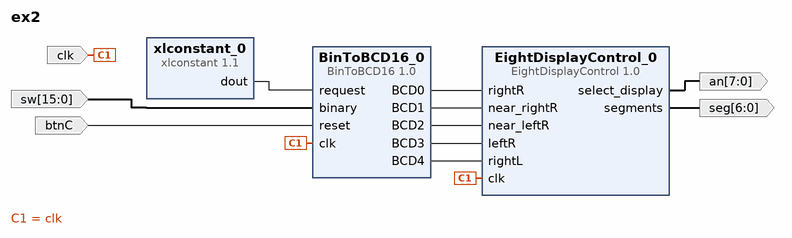
[diagram p0: block diagram of the top level]
# Vivado block design ex2, Vivado 2015.4
create_bd_design ex2

create_bd_port -dir I clk
create_bd_port -dir I -from 15 -to 0 sw
create_bd_port -dir O -from 7 -to 0 an
create_bd_port -dir O -from 6 -to 0 seg
create_bd_port -dir I btnC

create_bd_cell -type ip -vlnv ua.pt:user:BinToBCD16:1.0 BinToBCD16_0
create_bd_cell -type ip -vlnv xilinx.com:ip:xlconstant:1.1 xlconstant_0
create_bd_cell -type ip -vlnv ua.pt:user:EightDisplayControl:1.0 EightDisplayControl_0

# ---- connections ----

connect_bd_net [get_bd_pins xlconstant_0/dout] [get_bd_pins BinToBCD16_0/request]
connect_bd_net [get_bd_ports sw] [get_bd_pins BinToBCD16_0/binary]
connect_bd_net [get_bd_ports clk] [get_bd_pins BinToBCD16_0/clk] [get_bd_pins EightDisplayControl_0/clk]
connect_bd_net [get_bd_pins BinToBCD16_0/BCD0] [get_bd_pins EightDisplayControl_0/rightR]
connect_bd_net [get_bd_pins BinToBCD16_0/BCD1] [get_bd_pins EightDisplayControl_0/near_rightR]
connect_bd_net [get_bd_pins BinToBCD16_0/BCD2] [get_bd_pins EightDisplayControl_0/near_leftR]
connect_bd_net [get_bd_pins BinToBCD16_0/BCD3] [get_bd_pins EightDisplayControl_0/leftR]
connect_bd_net [get_bd_pins BinToBCD16_0/BCD4] [get_bd_pins EightDisplayControl_0/rightL]
connect_bd_net [get_bd_pins EightDisplayControl_0/select_display] [get_bd_ports an]
connect_bd_net [get_bd_pins EightDisplayControl_0/segments] [get_bd_ports seg]
connect_bd_net [get_bd_ports btnC] [get_bd_pins BinToBCD16_0/reset]

validate_bd_design
save_bd_design
